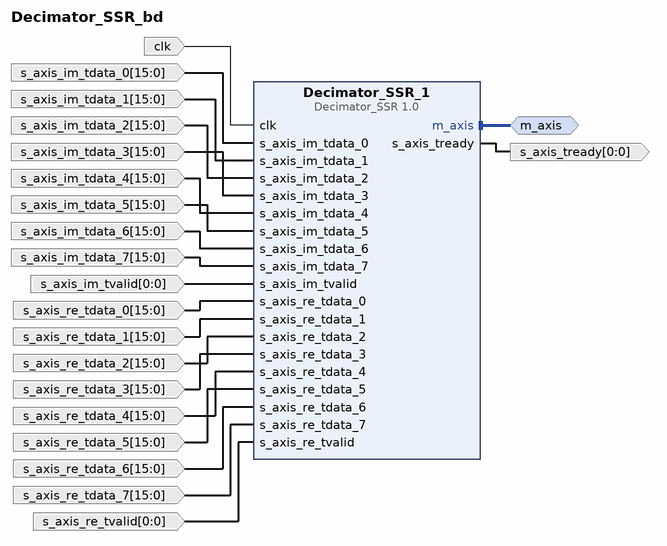
[diagram p0: block diagram of the top level]
# Vivado block design Decimator_SSR_bd, xczu28dr-ffvg1517-2-e, Vivado 2024.1
create_bd_design Decimator_SSR_bd

create_bd_intf_port -mode Master -vlnv xilinx.com:interface:axis_rtl:1.0 m_axis
create_bd_port -dir I -type clk clk
create_bd_port -dir I -from 15 -to 0 -type data s_axis_im_tdata_0
create_bd_port -dir I -from 15 -to 0 -type data s_axis_im_tdata_1
create_bd_port -dir I -from 15 -to 0 -type data s_axis_im_tdata_2
create_bd_port -dir I -from 15 -to 0 -type data s_axis_im_tdata_3
create_bd_port -dir I -from 15 -to 0 -type data s_axis_im_tdata_4
create_bd_port -dir I -from 15 -to 0 -type data s_axis_im_tdata_5
create_bd_port -dir I -from 15 -to 0 -type data s_axis_im_tdata_6
create_bd_port -dir I -from 15 -to 0 -type data s_axis_im_tdata_7
create_bd_port -dir I -from 0 -to 0 -type data s_axis_im_tvalid
create_bd_port -dir I -from 15 -to 0 -type data s_axis_re_tdata_0
create_bd_port -dir I -from 15 -to 0 -type data s_axis_re_tdata_1
create_bd_port -dir I -from 15 -to 0 -type data s_axis_re_tdata_2
create_bd_port -dir I -from 15 -to 0 -type data s_axis_re_tdata_3
create_bd_port -dir I -from 15 -to 0 -type data s_axis_re_tdata_4
create_bd_port -dir I -from 15 -to 0 -type data s_axis_re_tdata_5
create_bd_port -dir I -from 15 -to 0 -type data s_axis_re_tdata_6
create_bd_port -dir I -from 15 -to 0 -type data s_axis_re_tdata_7
create_bd_port -dir I -from 0 -to 0 -type data s_axis_re_tvalid
create_bd_port -dir O -from 0 -to 0 -type data s_axis_tready

create_bd_cell -type ip -vlnv CoRSoC:VMC:Decimator_SSR:1.0 Decimator_SSR_1

# ---- connections ----

connect_bd_intf_net [get_bd_intf_pins Decimator_SSR_1/m_axis] [get_bd_intf_ports m_axis]
connect_bd_net [get_bd_pins Decimator_SSR_1/s_axis_tready] [get_bd_ports s_axis_tready]
connect_bd_net [get_bd_ports clk] [get_bd_pins Decimator_SSR_1/clk]
connect_bd_net -net s_axis_im_tdata_0_1 [get_bd_ports s_axis_im_tdata_0] [get_bd_pins Decimator_SSR_1/s_axis_im_tdata_0]
connect_bd_net -net s_axis_im_tdata_1_1 [get_bd_ports s_axis_im_tdata_1] [get_bd_pins Decimator_SSR_1/s_axis_im_tdata_1]
connect_bd_net -net s_axis_im_tdata_2_1 [get_bd_ports s_axis_im_tdata_2] [get_bd_pins Decimator_SSR_1/s_axis_im_tdata_2]
connect_bd_net -net s_axis_im_tdata_3_1 [get_bd_ports s_axis_im_tdata_3] [get_bd_pins Decimator_SSR_1/s_axis_im_tdata_3]
connect_bd_net -net s_axis_im_tdata_4_1 [get_bd_ports s_axis_im_tdata_4] [get_bd_pins Decimator_SSR_1/s_axis_im_tdata_4]
connect_bd_net -net s_axis_im_tdata_5_1 [get_bd_ports s_axis_im_tdata_5] [get_bd_pins Decimator_SSR_1/s_axis_im_tdata_5]
connect_bd_net -net s_axis_im_tdata_6_1 [get_bd_ports s_axis_im_tdata_6] [get_bd_pins Decimator_SSR_1/s_axis_im_tdata_6]
connect_bd_net -net s_axis_im_tdata_7_1 [get_bd_ports s_axis_im_tdata_7] [get_bd_pins Decimator_SSR_1/s_axis_im_tdata_7]
connect_bd_net [get_bd_ports s_axis_im_tvalid] [get_bd_pins Decimator_SSR_1/s_axis_im_tvalid]
connect_bd_net -net s_axis_re_tdata_0_1 [get_bd_ports s_axis_re_tdata_0] [get_bd_pins Decimator_SSR_1/s_axis_re_tdata_0]
connect_bd_net -net s_axis_re_tdata_1_1 [get_bd_ports s_axis_re_tdata_1] [get_bd_pins Decimator_SSR_1/s_axis_re_tdata_1]
connect_bd_net -net s_axis_re_tdata_2_1 [get_bd_ports s_axis_re_tdata_2] [get_bd_pins Decimator_SSR_1/s_axis_re_tdata_2]
connect_bd_net -net s_axis_re_tdata_3_1 [get_bd_ports s_axis_re_tdata_3] [get_bd_pins Decimator_SSR_1/s_axis_re_tdata_3]
connect_bd_net -net s_axis_re_tdata_4_1 [get_bd_ports s_axis_re_tdata_4] [get_bd_pins Decimator_SSR_1/s_axis_re_tdata_4]
connect_bd_net -net s_axis_re_tdata_5_1 [get_bd_ports s_axis_re_tdata_5] [get_bd_pins Decimator_SSR_1/s_axis_re_tdata_5]
connect_bd_net -net s_axis_re_tdata_6_1 [get_bd_ports s_axis_re_tdata_6] [get_bd_pins Decimator_SSR_1/s_axis_re_tdata_6]
connect_bd_net -net s_axis_re_tdata_7_1 [get_bd_ports s_axis_re_tdata_7] [get_bd_pins Decimator_SSR_1/s_axis_re_tdata_7]
connect_bd_net [get_bd_ports s_axis_re_tvalid] [get_bd_pins Decimator_SSR_1/s_axis_re_tvalid]

validate_bd_design
save_bd_design
